# Altium schematic sheet 开关矩阵.SchDoc
size A4
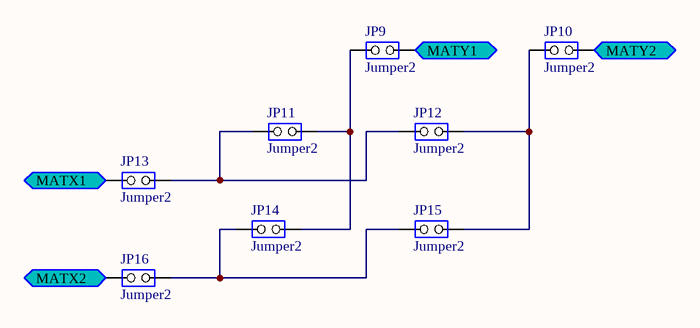
[diagram p0: 开关矩阵.SchDoc]

## Parts
JP9  Jumper2  [CON2-P2.54]
JP10  Jumper2  [CON2-P2.54]
JP11  Jumper2  [CON2-P2.54]
JP12  Jumper2  [CON2-P2.54]
JP13  Jumper2  [CON2-P2.54]
JP14  Jumper2  [CON2-P2.54]
JP15  Jumper2  [CON2-P2.54]
JP16  Jumper2  [CON2-P2.54]

## Ports
MATX1, MATX2, MATY1, MATY2

## Nets
MATX1: JP13.1(COMMON) ; port MATX1
MATX2: JP16.1(COMMON) ; port MATX2
MATY1: JP9.2(NO) ; port MATY1
MATY2: JP10.2(NO) ; port MATY2
NetJP9_1: JP9.1(COMMON) JP11.2(NO) JP14.2(NO)
NetJP10_1: JP10.1(COMMON) JP12.2(NO) JP15.2(NO)
NetJP11_1: JP11.1(COMMON) JP12.1(COMMON) JP13.2(NO)
NetJP14_1: JP14.1(COMMON) JP15.1(COMMON) JP16.2(NO)